# Altium schematic sheet mcu2.SchDoc
size A4
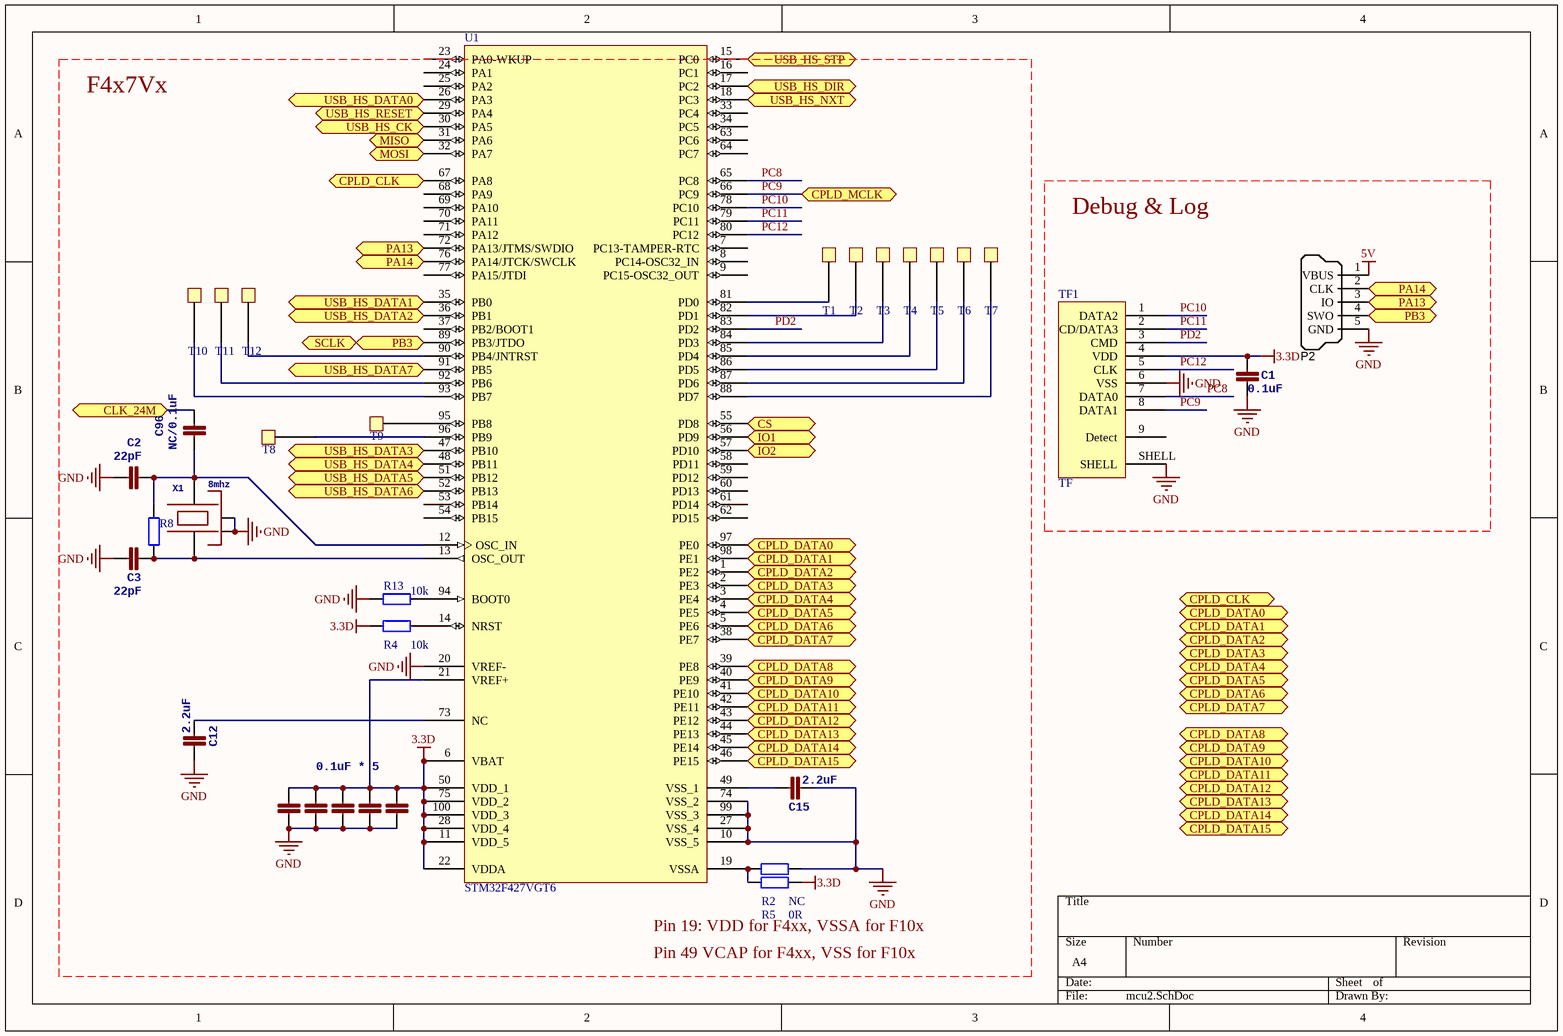
[diagram p0: mcu2.SchDoc]

## Parts
C1  0.1uF  [0402]
C2  22pF  [0402]
C3  22pF  [0402]
C4  0.1uF * 5  [0402]
C5  1n  [0402]  (value not drawn)
C6  1n  [0402]  (value not drawn)
C12  2.2uF  [0603]
C13  1n  [0402]  (value not drawn)
C14  1n  [0402]  (value not drawn)
C15  2.2uF  [0603]
C96  NC/0.1uF  [0402]
P2  SWD_MicroUSB  [MICRO-YZX]  (value not drawn)
R2  0R  [0402]
R4  10k  [0402]
R5  NC  [0402]
R8  (no value)  [0402]
R13  10k  [0402]
T1  TestPad  [TestPad - 1mm]  (value not drawn)
T2  TestPad  [TestPad - 1mm]  (value not drawn)
T3  TestPad  [TestPad - 1mm]  (value not drawn)
T4  TestPad  [TestPad - 1mm]  (value not drawn)
T5  TestPad  [TestPad - 1mm]  (value not drawn)
T6  TestPad  [TestPad - 1mm]  (value not drawn)
T7  TestPad  [TestPad - 1mm]  (value not drawn)
T8  TestPad  [TestPad - 1mm]  (value not drawn)
T9  TestPad  [TestPad - 1mm]  (value not drawn)
T10  TestPad  [TestPad - 1mm]  (value not drawn)
T11  TestPad  [TestPad - 1mm]  (value not drawn)
T12  TestPad  [TestPad - 1mm]  (value not drawn)
TF1  TF  [TF]
U1  STM32F427VGT6  [LQFP100_N]
X1  8mhz  [OSCILLATOR-3.2X2.5]

## Ports
CLK_24M, CPLD_CLK, CPLD_DATA0, CPLD_DATA1, CPLD_DATA2, CPLD_DATA3, CPLD_DATA4, CPLD_DATA5, CPLD_DATA6, CPLD_DATA7, CPLD_DATA8, CPLD_DATA9, CPLD_DATA10, CPLD_DATA11, CPLD_DATA12, CPLD_DATA13, CPLD_DATA14, CPLD_DATA15, CPLD_MCLK, CS, IO1, IO2, MISO, MOSI, PA13, PA14, PB3, SCLK, USB_HS_CK, USB_HS_DATA0, USB_HS_DATA1, USB_HS_DATA2, USB_HS_DATA3, USB_HS_DATA4, USB_HS_DATA5, USB_HS_DATA6, USB_HS_DATA7, USB_HS_DIR, USB_HS_NXT, USB_HS_RESET, USB_HS_STP

## Nets
3.3D: C1.2 C4.2 C5.2 C6.2 C13.2 C14.2 R2.1 R4.2 TF1.4(VDD) U1.6(VBAT) U1.11(VDD_5) U1.21(VREF+) U1.22(VDDA) U1.28(VDD_4) U1.50(VDD_1) U1.75(VDD_2) U1.100(VDD_3)
5V: P2.1(VBUS)
GND: C1.1 C2.2 C3.2 C4.1 C5.1 C6.1 C12.1 C13.1 C14.1 C15.2 P2.5(GND) R5.1 R13.1 TF1.6(VSS) TF1.SHELL U1.10(VSS_5) U1.20(VREF-) U1.27(VSS_4) U1.74(VSS_2) U1.99(VSS_3) X1.2(NC_2) X1.4(NC_4)
CLK_24M: C96.1 ; port CLK_24M
CPLD_CLK: U1.67(PA8) ; port CPLD_CLK
CPLD_DATA0: U1.97(PE0) ; port CPLD_DATA0
CPLD_DATA1: U1.98(PE1) ; port CPLD_DATA1
CPLD_DATA2: U1.1(PE2) ; port CPLD_DATA2
CPLD_DATA3: U1.2(PE3) ; port CPLD_DATA3
CPLD_DATA4: U1.3(PE4) ; port CPLD_DATA4
CPLD_DATA5: U1.4(PE5) ; port CPLD_DATA5
CPLD_DATA6: U1.5(PE6) ; port CPLD_DATA6
CPLD_DATA7: U1.38(PE7) ; port CPLD_DATA7
CPLD_DATA8: U1.39(PE8) ; port CPLD_DATA8
CPLD_DATA9: U1.40(PE9) ; port CPLD_DATA9
CPLD_DATA10: U1.41(PE10) ; port CPLD_DATA10
CPLD_DATA11: U1.42(PE11) ; port CPLD_DATA11
CPLD_DATA12: U1.43(PE12) ; port CPLD_DATA12
CPLD_DATA13: U1.44(PE13) ; port CPLD_DATA13
CPLD_DATA14: U1.45(PE14) ; port CPLD_DATA14
CPLD_DATA15: U1.46(PE15) ; port CPLD_DATA15
CS: U1.55(PD8) ; port CS
IO1: U1.56(PD9) ; port IO1
IO2: U1.57(PD10) ; port IO2
MISO: U1.31(PA6) ; port MISO
MOSI: U1.32(PA7) ; port MOSI
PA13: P2.3(IO) U1.72(PA13/JTMS/SWDIO) ; port PA13
PA14: P2.2(CLK) U1.76(PA14/JTCK/SWCLK) ; port PA14
PB3: P2.4(SWO) U1.89(PB3/JTDO) ; port SCLK, port PB3
PC8: TF1.7(DATA0) U1.65(PC8)
PC9: TF1.8(DATA1) U1.66(PC9) ; port CPLD_MCLK
PC10: TF1.1(DATA2) U1.78(PC10)
PC11: TF1.2(CD/DATA3) U1.79(PC11)
PC12: TF1.5(CLK) U1.80(PC12)
PD2: TF1.3(CMD) U1.83(PD2)
USB_HS_CK: U1.30(PA5) ; port USB_HS_CK
USB_HS_DATA0: U1.26(PA3) ; port USB_HS_DATA0
USB_HS_DATA1: U1.35(PB0) ; port USB_HS_DATA1
USB_HS_DATA2: U1.36(PB1) ; port USB_HS_DATA2
USB_HS_DATA3: U1.47(PB10) ; port USB_HS_DATA3
USB_HS_DATA4: U1.48(PB11) ; port USB_HS_DATA4
USB_HS_DATA5: U1.51(PB12) ; port USB_HS_DATA5
USB_HS_DATA6: U1.52(PB13) ; port USB_HS_DATA6
USB_HS_DATA7: U1.91(PB5) ; port USB_HS_DATA7
USB_HS_DIR: U1.17(PC2) ; port USB_HS_DIR
USB_HS_NXT: U1.18(PC3) ; port USB_HS_NXT
USB_HS_RESET: U1.29(PA4) ; port USB_HS_RESET
USB_HS_STP: U1.15(PC0) ; port USB_HS_STP
NetC2_1: C2.1 C96.2 R8.2 U1.12(OSC_IN) X1.3
NetC3_1: C3.1 R8.1 U1.13(OSC_OUT) X1.1
NetC12_2: C12.2 U1.73(NC)
NetC15_1: C15.1 U1.49(VSS_1)
NetR2_2: R2.2 R5.2 U1.19(VSSA)
NetR4_1: R4.1 U1.14(NRST)
NetR13_2: R13.2 U1.94(BOOT0)
NetT1_1: T1.1 U1.81(PD0)
NetT2_1: T2.1 U1.82(PD1)
NetT3_1: T3.1 U1.84(PD3)
NetT4_1: T4.1 U1.85(PD4)
NetT5_1: T5.1 U1.86(PD5)
NetT6_1: T6.1 U1.87(PD6)
NetT7_1: T7.1 U1.88(PD7)
NetT8_1: T8.1 U1.96(PB9)
NetT9_1: T9.1 U1.95(PB8)
NetT10_1: T10.1 U1.93(PB7)
NetT11_1: T11.1 U1.92(PB6)
NetT12_1: T12.1 U1.90(PB4/JNTRST)

Not connected (* = marked no-connect by the designer): TF1 9(Detect); U1 7(PC13-TAMPER-RTC) 8(PC14-OSC32_IN) 9(PC15-OSC32_OUT) 16(PC1) 23(PA0-WKUP) 24(PA1) 25(PA2) 33(PC4) 34(PC5) 37(PB2/BOOT1) 53(PB14) 54(PB15) 58(PD11) 59(PD12) 60(PD13) 61(PD14) 62(PD15) 63(PC6) 64(PC7) 68(PA9) 69(PA10) 70(PA11) 71(PA12) 77(PA15/JTDI)

## Notes on the sheet
- F4x7Vx
- Debug & Log
- Pin 19: VDD for F4xx, VSSA for F10x
- Pin 49 VCAP for F4xx, VSS for F10x

## Library data of the parts
C1-C6 C12-C15 C96 = CAP0402-CAP: <b>Capacitor</b> / Standard 0603 ceramic capacitor, and 0.1" leaded capacitor.; PARTNO: CC0402ZRY5V7BB104
P2 = SWD_MicroUSB: Connector SMD USB Micro Type B middle mount; Manufacturer 1: Molex Inc; SCDType: undef; Package / Case: SMD; Supplier 1: Digi-Key; Supplier Part Number 1: WM17142CT-ND
R2 R4 R5 R8 R13 = Res2: Resistor; Value: 0Ohm; Published: 8-Jun-2000; LatestRevisionDate: 17-Jul-2002; LatestRevisionNote: Re-released for DXP Platform.; PackageReference: AXIAL-0.4; Publisher: Altium Limited; PackageDescription: Axial Device, Thru-Hole; 2 Leads; 0.4 in Pin Spacing
U1 = STM32F103VBT6: STM32 ARM-based 32-bit MCU with 64 Kbytes Flash, 100-pin LQFP, Industrial Temperature; Published: *; DatasheetVersion: *; PackageVersion: *; PackageReference: *; Publisher: *; PackageDescription: *; ComponentLink1Description: *; ComponentLink1URL: *; ComponentLink2Description: *; ComponentLink2URL: *
X1 = OSCILLATOR-3.2X2.5: Crystal Oscillator in 3.2x2.5 SMD